# Altium schematic sheet obc-v2_CM4-SPI-UART.SchDoc
size 420 x 297 mm; SheetNumber: 17; SheetTotal: 23
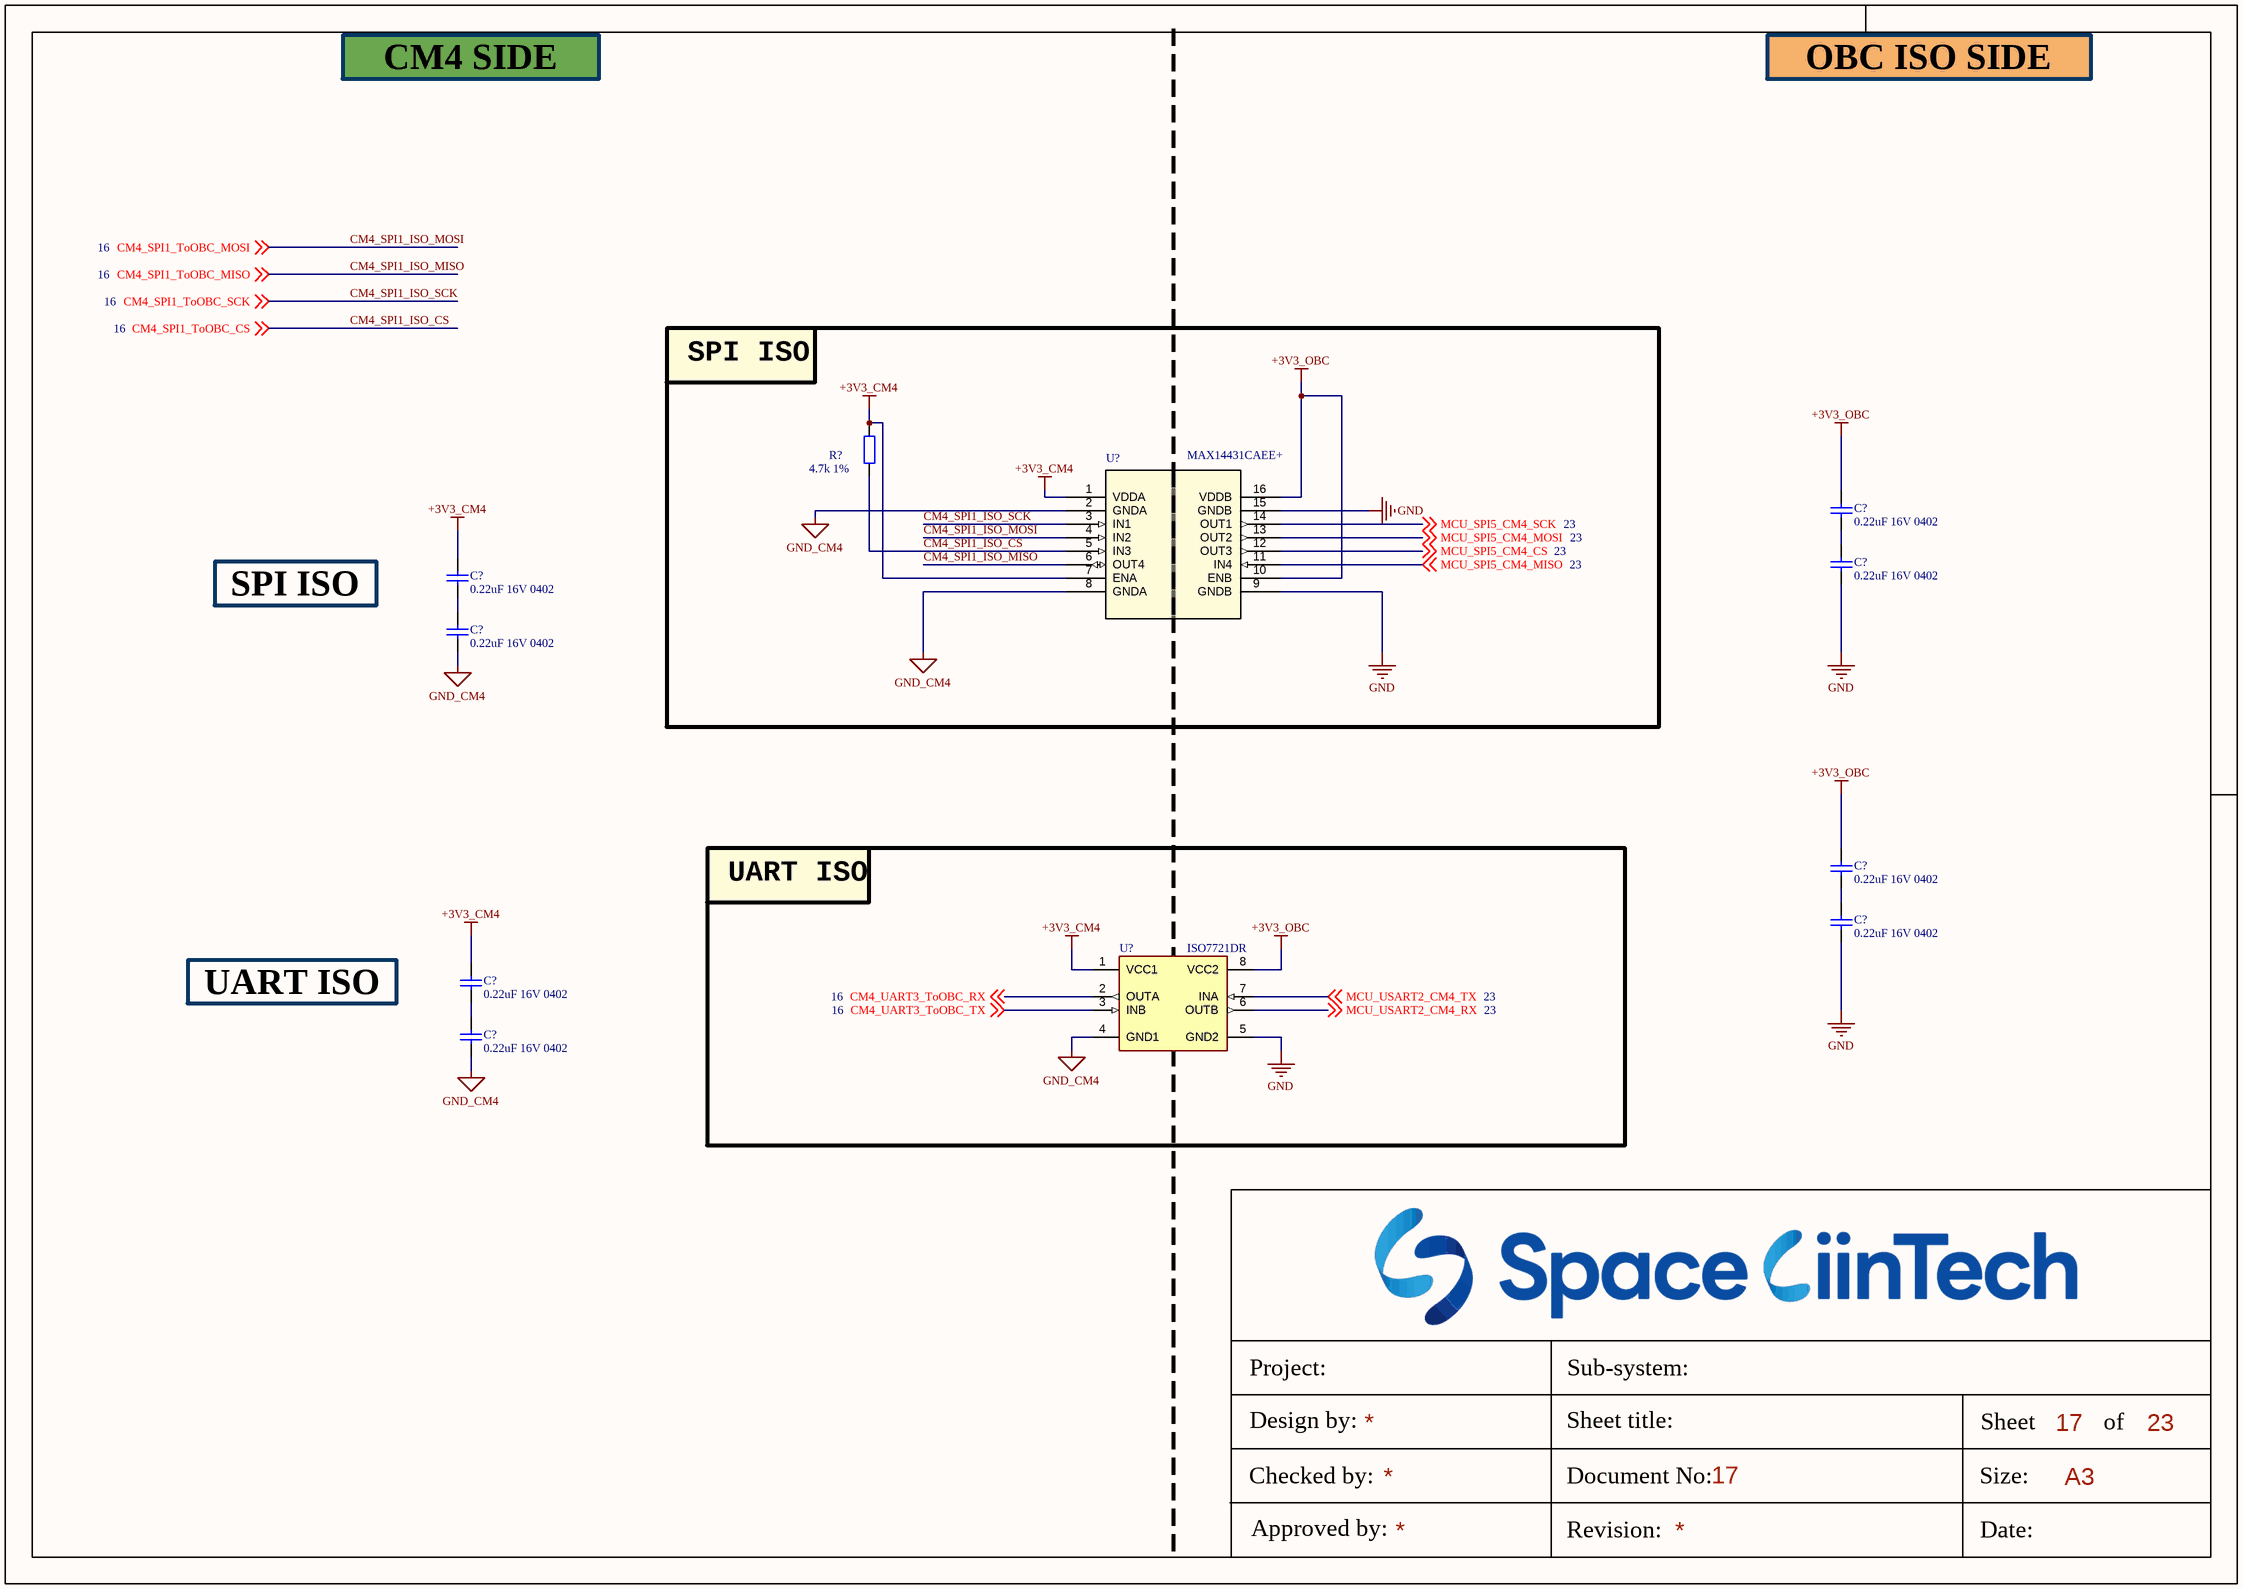
[diagram p0: obc-v2_CM4-SPI-UART.SchDoc]

## Parts
(Parts that share a designator on the sheet are numbered #1, #2 ... from top to bottom, then left to right.)
C?#1  0.22uF 16V 0402  [tu 0402]
C?#2  0.22uF 16V 0402  [tu 0402]
C?#3  0.22uF 16V 0402  [tu 0402]
C?#4  0.22uF 16V 0402  [tu 0402]
C?#5  0.22uF 16V 0402  [tu 0402]
C?#6  0.22uF 16V 0402  [tu 0402]
C?#7  0.22uF 16V 0402  [tu 0402]
C?#8  0.22uF 16V 0402  [tu 0402]
R?  4.7k 1%  [tro smd 0603]
U?#1  MAX14431CAEE+  [21-0055Q_E16MS+1F_MXM]
U?#2  ISO7721DR  [SOIC127P599X175-8N]

## Blocks framed on the sheet
SPI ISO: R? U?#1
UART ISO: U?#2

## Nets
+3V3_CM4: C?#3.1 C?#7.1 R?.2 U?#1.1(VDDA) U?#1.7(ENA) U?#2.1(VCC1)
+3V3_OBC: C?#1.2 C?#5.2 U?#1.10(ENB) U?#1.16(VDDB) U?#2.8(VCC2)
GND: C?#2.1 C?#6.1 U?#1.9(GNDB) U?#1.15(GNDB) U?#2.5(GND2)
GND_CM4: C?#4.2 C?#8.2 U?#1.2(GNDA) U?#1.8(GNDA) U?#2.4(GND1)
CM4_SPI1_ISO_CS: R?.1 U?#1.5(IN3) ; off-sheet CM4_SPI1_ToOBC_CS  [also labelled CM4_SPI1_ToOBC_CS]
CM4_SPI1_ISO_MISO: U?#1.6(OUT4) ; off-sheet CM4_SPI1_ToOBC_MISO  [also labelled CM4_SPI1_ToOBC_MISO]
CM4_SPI1_ISO_MOSI: U?#1.4(IN2) ; off-sheet CM4_SPI1_ToOBC_MOSI  [also labelled CM4_SPI1_ToOBC_MOSI]
CM4_SPI1_ISO_SCK: U?#1.3(IN1) ; off-sheet CM4_SPI1_ToOBC_SCK  [also labelled CM4_SPI1_ToOBC_SCK]
CM4_UART3_ToOBC_RX: U?#2.2(OUTA) ; off-sheet CM4_UART3_ToOBC_RX
CM4_UART3_ToOBC_TX: U?#2.3(INB) ; off-sheet CM4_UART3_ToOBC_TX
MCU_SPI5_CM4_CS: U?#1.12(OUT3) ; off-sheet MCU_SPI5_CM4_CS
MCU_SPI5_CM4_MISO: U?#1.11(IN4) ; off-sheet MCU_SPI5_CM4_MISO
MCU_SPI5_CM4_MOSI: U?#1.13(OUT2) ; off-sheet MCU_SPI5_CM4_MOSI
MCU_SPI5_CM4_SCK: U?#1.14(OUT1) ; off-sheet MCU_SPI5_CM4_SCK
MCU_USART2_CM4_RX: U?#2.6(OUTB) ; off-sheet MCU_USART2_CM4_RX
MCU_USART2_CM4_TX: U?#2.7(INA) ; off-sheet MCU_USART2_CM4_TX
NetC?#1_1: C?#1.1 C?#2.2
NetC?#3_2: C?#3.2 C?#4.1
NetC?#5_1: C?#5.1 C?#6.2
NetC?#7_2: C?#7.2 C?#8.1

## Notes on the sheet
- CM4 SIDE
- OBC ISO SIDE
- SPI ISO
- UART ISO
- Project:
- Sub-system:
- Design by:
- Sheet title:
- Sheet
- A3
- of
- Checked by:
- Approved by:
- Revision:
- Document No:
- Size:
- Date:

## Library data of the parts
C?#1-C?#8 = Tu 0402 33nF 10V: 0.22 µF ±10% 16V Ceramic Capacitor X7R 0402 (1005 Metric): GCM155R71C224KE02D; Chung_Loai: Dán; Don_Vi: Con; So_Chan: 2; Ten_Linh_Kien: Tụ 0402 33nF X7R 10V GRM155R71A333KA01D; Ma_Hang: MH007853; Kieu_Chan: *
R? = Tro 0603 1% 10k: RES 4.7K OHM 1% 1/10W 0603, P/N: ERJ-U03F4701V; Chung_Loai: Dán; Don_Vi: Con; So_Chan: 2; Ten_Linh_Kien: Trở 0603 1% 10k; Ma_Hang: MH006333; Kieu_Chan: *
U?#1 = MAX14431CAEE+: No Description Available; Mfr_Name: Analog Devices / Maxim Integrated; RefDes: RefDes; Type: Type
U?#2 = ISO7721DR: Robust EMC, dual-channel, 1/1, reinforced digital isolator 8-SOIC -55 to 125; Package: None; Value: *; MP: ISO7721DR; Availability: Unavailable; Price: None